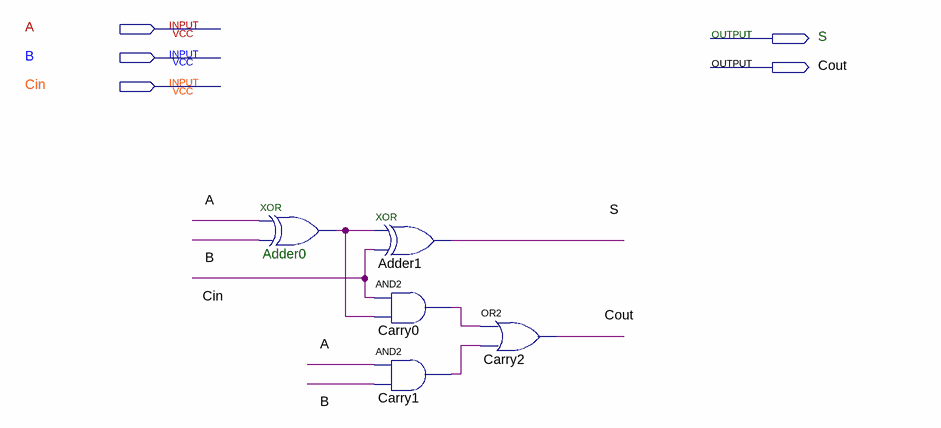
[diagram p0: schematic sheet]
// Quartus schematic FA.bdf as structural Verilog: 5 symbols, 5 pins
module FA (
  input  A,
  input  B,
  input  Cin,
  output S,
  output Cout
);

  wire Adder0_out, Carry0_out, Carry1_out;

  xor Adder0 (Adder0_out, A, B);
  xor Adder1 (S, Adder0_out, Cin);
  and Carry0 (Carry0_out, Cin, Adder0_out);
  and Carry1 (Carry1_out, A, B);
  or Carry2 (Cout, Carry0_out, Carry1_out);
endmodule
